# Altium schematic sheet STM32 MCU.SchDoc
size A4; Organization: TESLA Motors, INC; Address1: 3500 Deer Creek Road; Address2: Palo Alto, CA; Address4: U.S.A.; SheetNumber: 9; SheetTotal: 14
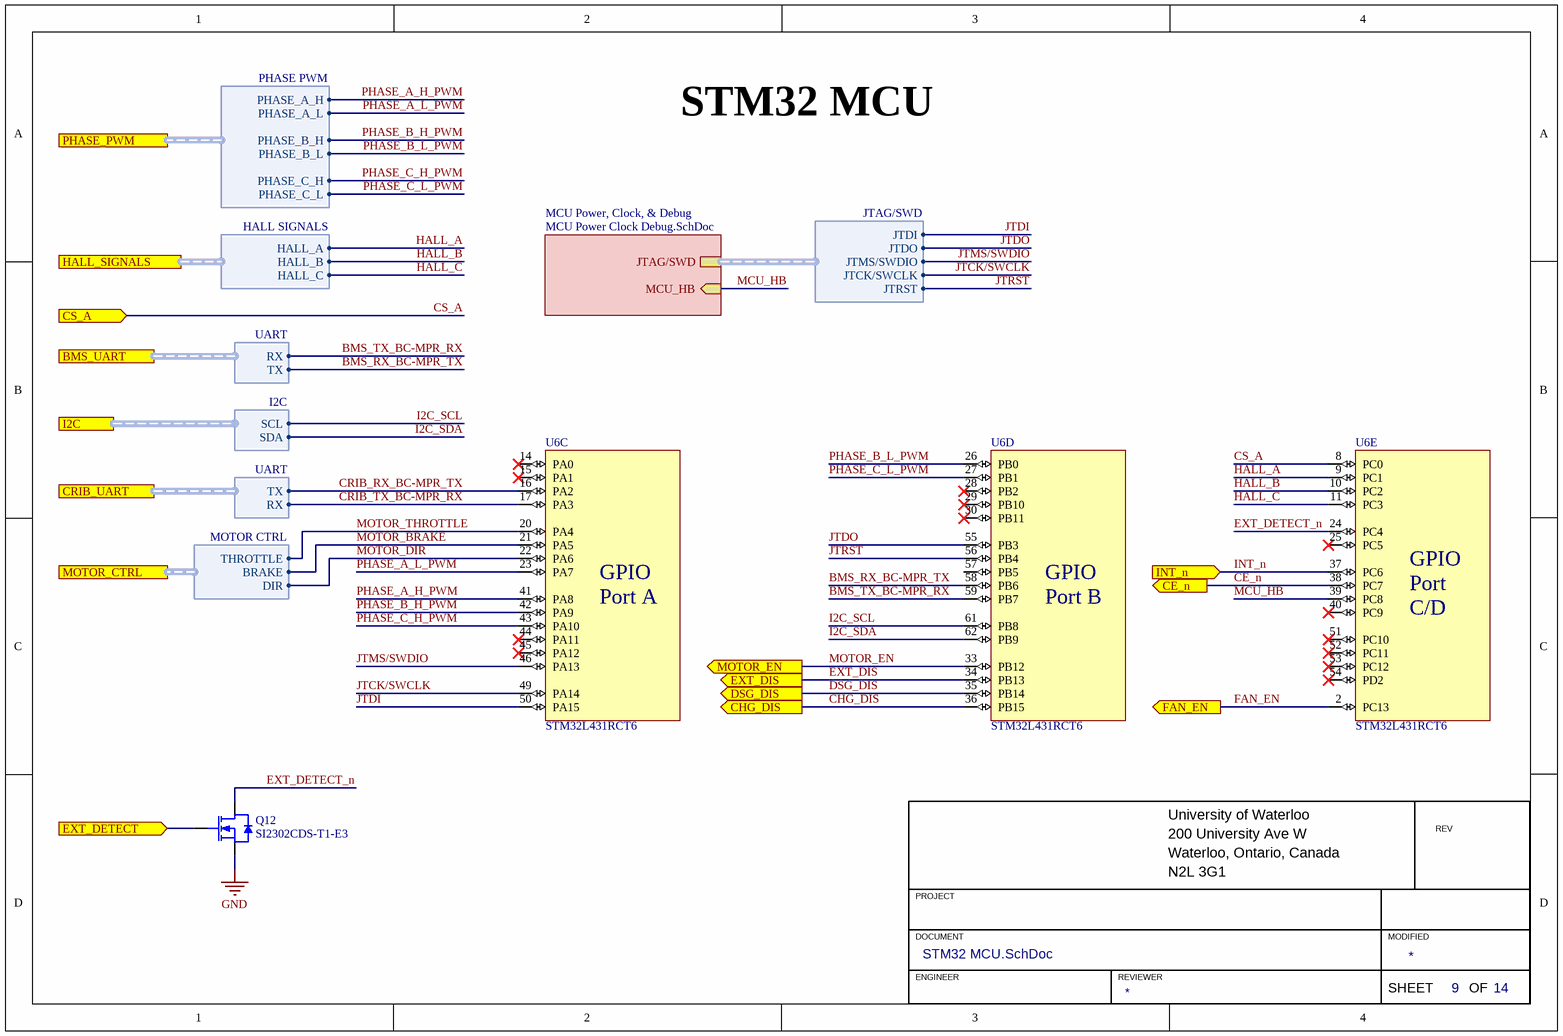
[diagram p0: STM32 MCU.SchDoc]

## Parts
Q12  Manufacturer Part Number 1: SI2302CDS-T1-E3  [SOT23-3]  (hidden comment: NMOS_20V_6A)
U6  STM32L431RCT6  [STM_LQFP64]  (parts C,D,E of 5)

## Sub-sheets
MCU Power, Clock, & Debug = MCU Power Clock Debug.SchDoc: JTAG/SWD (harness JTAG/SWD), MCU_HB (in)

## Ports
BMS_UART (harness UART), CE_n (out), CHG_DIS (out), CRIB_UART (harness UART), CS_A (in), DSG_DIS (out), EXT_DETECT (in), EXT_DIS (out), FAN_EN (out), HALL_SIGNALS (harness HALL SIGNALS), I2C (harness I2C), INT_n (in), MOTOR_CTRL (harness MOTOR CTRL), MOTOR_EN (out), PHASE_PWM (harness PHASE PWM)

## Harnesses
JTAG/SWD: JTRST, JTDI, JTMS/SWDIO, JTCK/SWCLK, JTDO
PHASE PWM: PHASE_A_H, PHASE_A_L, PHASE_B_H, PHASE_B_L, PHASE_C_H, PHASE_C_L
HALL SIGNALS: HALL_A, HALL_B, HALL_C
UART: TX, RX
I2C: SCL, SDA
MOTOR CTRL: THROTTLE, BRAKE, DIR

## Nets
GND: Q12.2(SOURCE)
BMS_RX_BC-MPR_TX: U6.58(PB6) ; port BMS_UART.TX
BMS_TX_BC-MPR_RX: U6.59(PB7) ; port BMS_UART.RX
CE_n: U6.38(PC7) ; port CE_n
CHG_DIS: U6.36(PB15) ; port CHG_DIS
CRIB_RX_BC-MPR_TX: U6.16(PA2) ; port CRIB_UART.TX
CRIB_TX_BC-MPR_RX: U6.17(PA3) ; port CRIB_UART.RX
CS_A: U6.8(PC0) ; port CS_A
DSG_DIS: U6.35(PB14) ; port DSG_DIS
EXT_DETECT: Q12.1(GATE) ; port EXT_DETECT
EXT_DETECT_n: Q12.3(DRAIN) U6.24(PC4)
EXT_DIS: U6.34(PB13) ; port EXT_DIS
FAN_EN: U6.2(PC13) ; port FAN_EN
HALL_A: U6.9(PC1) ; port HALL_SIGNALS.HALL_A
HALL_B: U6.10(PC2) ; port HALL_SIGNALS.HALL_B
HALL_C: U6.11(PC3) ; port HALL_SIGNALS.HALL_C
I2C_SCL: U6.61(PB8) ; port I2C.SCL
I2C_SDA: U6.62(PB9) ; port I2C.SDA
INT_n: U6.37(PC6) ; port INT_n
JTCK/SWCLK: U6.49(PA14) ; sheet MCU Power, Clock, & Debug/JTAG/SWD.JTCK/SWCLK
JTDI: U6.50(PA15) ; sheet MCU Power, Clock, & Debug/JTAG/SWD.JTDI
JTDO: U6.55(PB3) ; sheet MCU Power, Clock, & Debug/JTAG/SWD.JTDO
JTMS/SWDIO: U6.46(PA13) ; sheet MCU Power, Clock, & Debug/JTAG/SWD.JTMS/SWDIO
JTRST: U6.56(PB4) ; sheet MCU Power, Clock, & Debug/JTAG/SWD.JTRST
MCU_HB: U6.39(PC8) ; sheet MCU Power, Clock, & Debug/MCU_HB
MOTOR_BRAKE: U6.21(PA5) ; port MOTOR_CTRL.BRAKE
MOTOR_DIR: U6.22(PA6) ; port MOTOR_CTRL.DIR
MOTOR_EN: U6.33(PB12) ; port MOTOR_EN
MOTOR_THROTTLE: U6.20(PA4) ; port MOTOR_CTRL.THROTTLE
PHASE_A_H_PWM: U6.41(PA8) ; port PHASE_PWM.PHASE_A_H
PHASE_A_L_PWM: U6.23(PA7) ; port PHASE_PWM.PHASE_A_L
PHASE_B_H_PWM: U6.42(PA9) ; port PHASE_PWM.PHASE_B_H
PHASE_B_L_PWM: U6.26(PB0) ; port PHASE_PWM.PHASE_B_L
PHASE_C_H_PWM: U6.43(PA10) ; port PHASE_PWM.PHASE_C_H
PHASE_C_L_PWM: U6.27(PB1) ; port PHASE_PWM.PHASE_C_L

Not connected (* = marked no-connect by the designer): U6 14(PA0)* 15(PA1)* 25(PC5)* 28(PB2)* 29(PB10)* 30(PB11)* 40(PC9)* 44(PA11)* 45(PA12)* 51(PC10)* 52(PC11)* 53(PC12)* 54(PD2)* 57(PB5)

## Notes on the sheet
- STM32 MCU
- University of Waterloo
- 200 University Ave W
- REV
- PROJECT
- Waterloo, Ontario, Canada
- N2L 3G1
- DOCUMENT
- ENGINEER
- REVIEWER
- MODIFIED
- SHEET
- OF
- (in symbol STM32L431RCT6, part C) GPIO / Port A
- (in symbol STM32L431RCT6, part D) GPIO / Port B
- (in symbol STM32L431RCT6, part E) GPIO / Port C/D

## Library data of the parts
Q12 = NMOS_20V_2.6A: MOSFET N-CH 20V 2.6A SOT23-3; Manufacturer 1: Vishay Siliconix; Package/Footprint: SOT-23-3; Supplier 1: Digi-Key; Supplier Part Number 1: SI2302CDS-T1-E3CT-ND
U6 = STM32L431RCT6: IC MCU 32BIT 256KB FLASH 64LQFP; Manufacturer 1: STMicroelectronics; Package/Footprint: 64-LQFP; Manufacturer Part Number 1: STM32L431RCT6; Supplier 1: Digi-Key; Supplier Part Number 1: 497-17960-ND